# EAGLE design astronaut_interface (EAGLE 7.5.0)
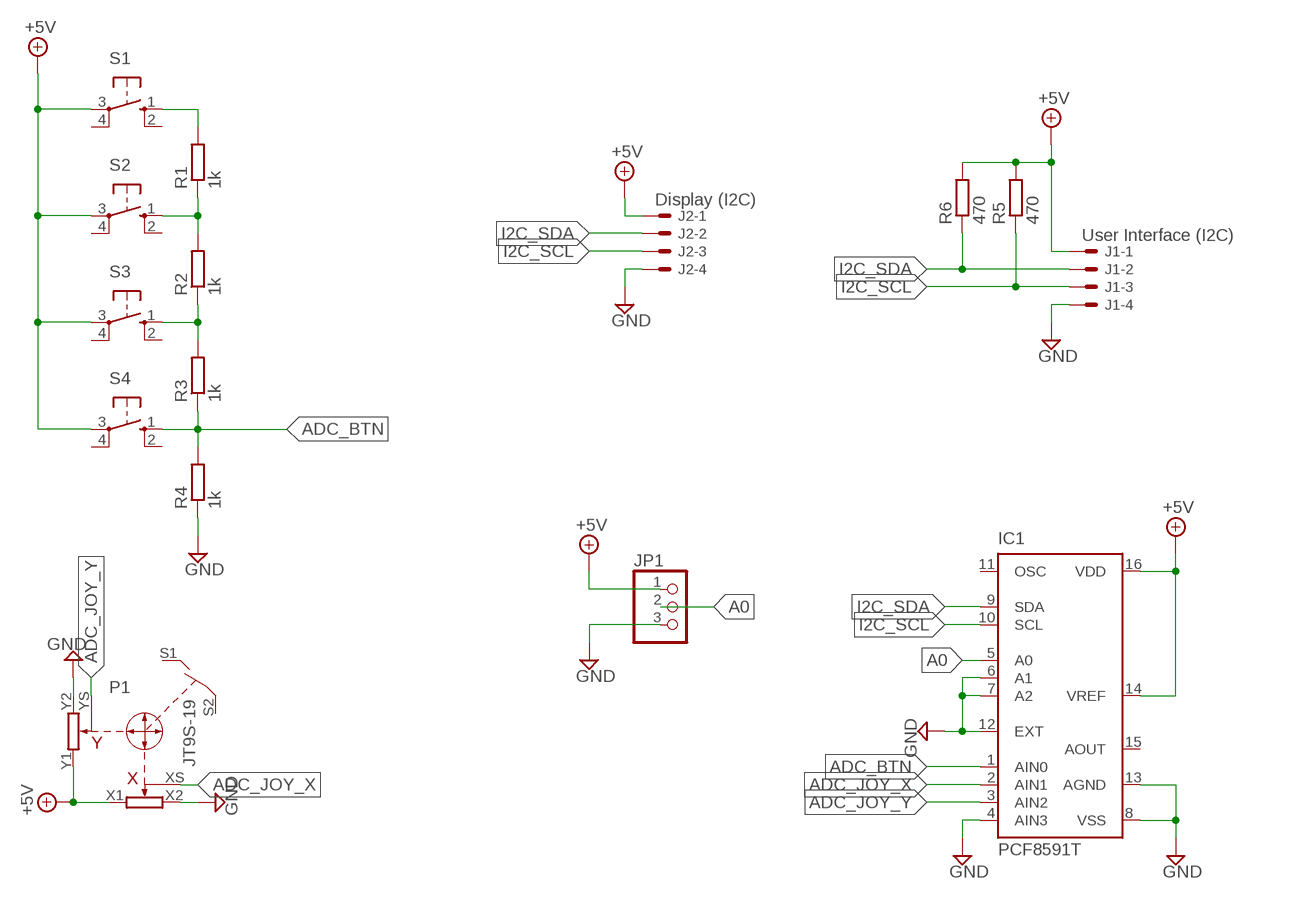
[diagram p0: schematic, sheet 1]

## Parts
IC1  PCF8591T  [SO16W]
J1  User Interface (I2C)  22-05-7048-04  [7395-04]
J2  Display (I2C)  22-05-7048-04  [7395-04]
JP1  PINHD-1X3  [1X03]
P1  JT9S-19  [JT9S-1P]
R1  1k  R-EU_R0805  [R0805]
R2  1k  R-EU_R0805  [R0805]
R3  1k  R-EU_R0805  [R0805]
R4  1k  R-EU_R0805  [R0805]
R5  470  R-EU_M0805  [M0805]
R6  470  R-EU_M0805  [M0805]
S1  10-XX  [B3F-10XX]
S2  10-XX  [B3F-10XX]
S3  10-XX  [B3F-10XX]
S4  10-XX  [B3F-10XX]

## Nets
+5V: IC1.14(VREF) IC1.16(VDD) J1.1 J2.1 JP1.1 P1.X1 P1.Y1 R5.2 R6.2 S1.3(P) S2.3(P) S3.3(P) S4.3(P)
A0: IC1.5(A0) JP1.2
ADC_BTN: IC1.1(AIN0) R3.1 R4.2 S4.1(S)
ADC_JOY_X: IC1.2(AIN1) P1.XS
ADC_JOY_Y: IC1.3(AIN2) P1.YS
GND: IC1.4(AIN3) IC1.6(A1) IC1.7(A2) IC1.8(VSS) IC1.12(EXT) IC1.13(AGND) J1.4 J2.4 JP1.3 P1.X2 P1.Y2 R4.1
I2C_SCL: IC1.10(SCL) J1.3 J2.3 R5.1
I2C_SDA: IC1.9(SDA) J1.2 J2.2 R6.1
N$4: R1.2 S1.1(S)
N$6: R2.1 R3.2 S3.1(S)
N$7: R1.1 R2.2 S2.1(S)
Unconnected: IC1.11(OSC) IC1.15(AOUT) P1.S1 P1.S2 S1.2(S1) S1.4(P1) S2.2(S1) S2.4(P1) S3.2(S1) S3.4(P1) S4.2(S1) S4.4(P1)

## Library data of the parts
IC1 = micro-philips:PCF8591: I2C-Bus D/A CONVERTER; MPN: PCF8591T/2,512; OC_FARNELL: 1826767; OC_NEWARK: 70R6911
J1 J2 = EP_molex_6410_7395:22-?-04: CONNECTOR wire to board 2.54 mm (.1 inch) pitch header
JP1 = pinhead:PINHD-1X3: PIN HEADER
P1 = jt9s-1p:JT9S-19: Joystick Potentiometer 10k
R1-R4 = rcl:R-EU_: RESISTOR, European symbol
R5 R6 = resistor:R-EU_: RESISTOR, European symbol
S1-S4 = switch-omron:10-XX: OMRON SWITCH; MPN: B3F-1000; OC_FARNELL: 176432; OC_NEWARK: 36M3542

## Board
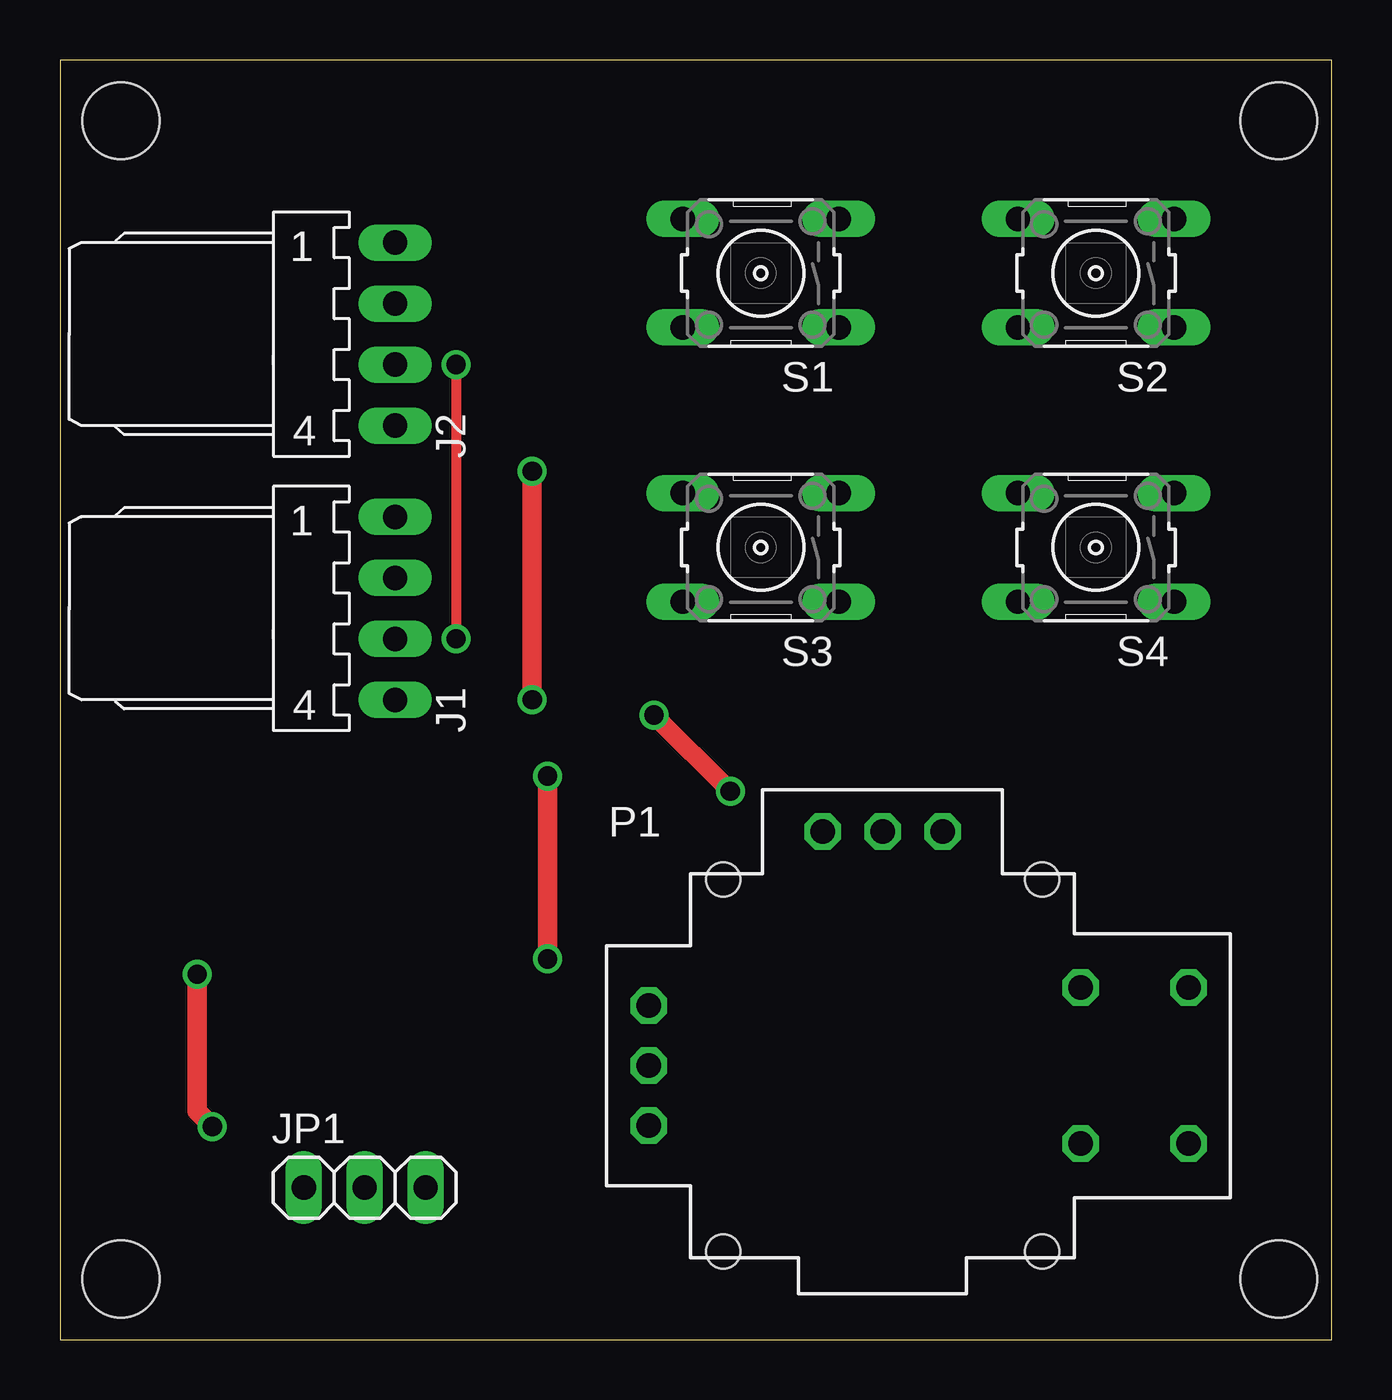
[diagram p1: board, top side]
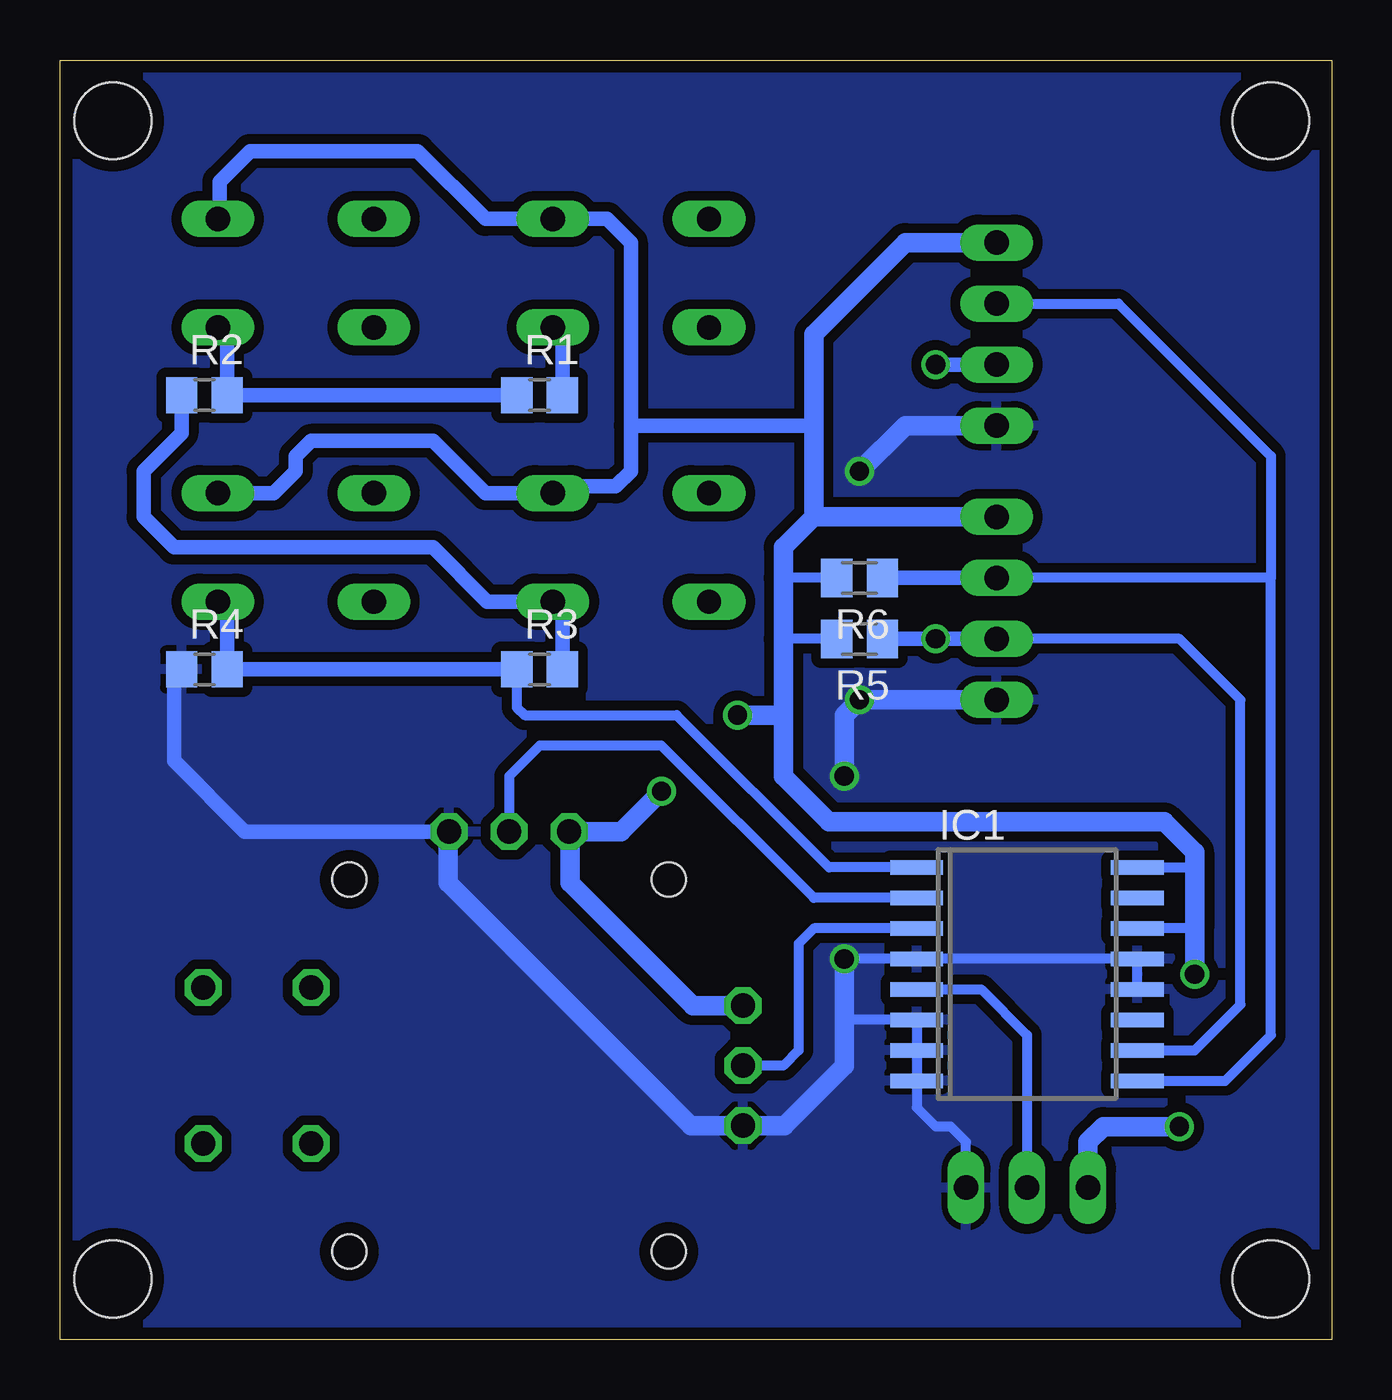
[diagram p2: board, bottom side, seen from below]

Size 53.01 x 53.33 mm. Coordinates in mm from the lower left corner, seen from the top.
Outline: 0,0 53.01,0 53.01,53.33 0,53.33 0,0
Copper layers (1*16): Top 0.035mm / dielectric 1.5mm / Bottom 0.035mm
Design rules "default *": minimum track width 12mil, minimum drill 24mil, track to track 12mil, track to pad 12mil, pad to pad 10mil, via to via 12mil, smd to smd 10mil, copper to edge 20mil, drill to drill 12mil, minimum pad ring 10mil, minimum via ring 8mil, stop-mask expansion 4mil, vias tented up to drill 0mil, thermal gap 10mil
Holes 3.2 mm at 50.8,2.54 50.8,50.8 2.54,50.8 2.54,2.54

### Footprints (pad centres in the part's own frame; a part is rotated, then mirrored left to right if it is on the bottom)
SO16W = smd 0.6 x 2.2: 1 -4.445,-4.6; 2 -3.175,-4.6; 3 -1.905,-4.6; 4 -0.635,-4.6; 5 0.635,-4.6; 6 1.905,-4.6; 7 3.175,-4.6; 8 4.445,-4.6; 9 4.445,4.6; 10 3.175,4.6; 11 1.905,4.6; 12 0.635,4.6; 13 -0.635,4.6; 14 -1.905,4.6; 15 -3.175,4.6; 16 -4.445,4.6
7395-04 = drill 1.016 long: 1 3.81,0; 2 1.27,0; 3 -1.27,0; 4 -3.81,0
1X03 = drill 1.016 long: 1 -2.54,0; 2 0,0; 3 2.54,0
JT9S-1P = drill 1.016 octagon: S1 8.25,-3.25; S2 12.75,3.25; S3 12.75,-3.25; S4 8.25,3.25; X1 -2.5,9.75; X2 2.5,9.75; XS 0,9.75; Y1 -9.75,2.5; Y2 -9.75,-2.5; YS -9.75,0 | hole 1.422: -6.65,7.75; 6.65,7.75; 6.65,-7.75; -6.65,-7.75
R0805 = smd 1.3 x 1.5: 1 -0.95,0; 2 0.95,0
M0805 = smd 1.3 x 1.6: 1 -0.95,0; 2 0.95,0
B3F-10XX = drill 1.016 long: 1 -3.251,2.261; 2 3.251,2.261; 3 -3.251,-2.261; 4 3.251,-2.261

### Placement (x,y rotation side)
IC1  12.7,15.24 270 bottom
J1  13.97,30.48 90 top
J2  13.97,41.91 90 top
JP1  12.7,6.35 0 top
P1  34.29,11.43 0 top
R1  33.02,39.37 0 bottom
R2  46.99,39.37 0 bottom
R3  33.02,27.94 0 bottom
R4  46.99,27.94 0 bottom
R5  19.69,29.21 180 bottom
R6  19.69,31.75 180 bottom
S1  29.21,44.45 180 top
S2  43.18,44.45 180 top
S3  29.21,33.02 180 top
S4  43.18,33.02 180 top

### Tracks (layer width: path | path; a pad name or v marks a point on that pad's centre or on a via)
+5V  (via drill 0.8)
  Top 0.813: v6.35,8.89 5.72,9.53 v5.72,15.24 | v27.94,22.86 v24.77,26.04
  Bottom 0.406: 46.36,46.79 S2.3 | 5.72,17.14 IC1.14 | IC1.16 5.72,19.68 | R6.2 22.86,31.75 | R5.2 22.86,29.21 | 31.75,21.14 P1.X1
  Bottom 0.61: 46.36,46.79 46.36,48.26 45.09,49.53 38.1,49.53 35.28,46.71 S1.3 30.2,46.71 29.21,45.72 29.21,38.1 | 29.21,38.1 29.21,36.2 29.84,35.56 32.18,35.56 S3.3 35.28,35.28 37.47,37.47 42.55,37.47 43.18,36.83 43.18,36.2 44.09,35.28 S4.3 | 21.59,38.1 29.21,38.1
  Bottom 0.813: JP1.1 10.16,8.26 9.52,8.89 v6.35,8.89 | v5.72,15.24 5.72,17.14 5.72,19.68 5.72,20.32 6.99,21.59 20.96,21.59 22.86,23.5 22.86,26.04 | J1.1 21.59,34.29 | J2.1 17.78,45.72 21.59,41.91 21.59,38.1 21.59,34.29 | P1.Y1 26.63,13.93 31.75,19.05 31.75,21.14 | P1.X1 29.62,21.18 v27.94,22.86 | 22.86,26.04 22.86,29.21 22.86,31.75 22.86,33.02 21.59,34.29 | v24.77,26.04 22.86,26.04
A0
  Bottom 0.406: IC1.5 14.61,14.61 12.7,12.7 JP1.2
ADC_BTN
  Bottom 0.406: IC1.1 20.96,19.68 27.3,26.04 33.66,26.04 33.97,26.35 R3.1
  Bottom 0.61: S4.1 46.04,30.37 R4.2 R3.1
ADC_JOY_X
  Bottom 0.406: P1.XS 34.29,23.5 33.02,24.77 27.94,24.77 21.59,18.41 IC1.2
ADC_JOY_Y
  Bottom 0.406: P1.YS 22.86,11.43 22.23,12.06 22.23,16.51 21.59,17.14 IC1.3
GND  (via drill 0.8)
  Top 0.813: v19.69,26.67 v19.69,36.2 | v20.32,15.88 v20.32,23.5
  Bottom 0.406: 36.83,21.14 P1.X2 | IC1.12 IC1.13 IC1.4 v20.32,15.88 | 20.32,13.34 IC1.6 IC1.7 IC1.8 17.3,9.68 16.51,8.89 15.88,8.89 15.24,8.26 JP1.3
  Bottom 0.61: P1.X2 45.31,21.18 48.26,24.13 48.26,27.62 R4.1
  Bottom 0.813: 36.83,21.14 36.83,19.05 26.71,8.93 P1.Y2 22.82,8.93 20.32,11.43 20.32,13.34 v20.32,15.88 | J1.4 v19.69,26.67 20.32,26.04 v20.32,23.5 | v19.69,36.2 17.78,38.1 J2.4
  pour Bottom (isolate 0.406): 0,53.34 53.34,53.34 53.34,0 0,0
I2C_SCL  (via drill 0.8)
  Top 0.406: v16.51,40.64 v16.51,29.21
  Bottom 0.406: IC1.10 5.72,12.06 3.81,13.97 3.81,26.67 6.35,29.21 J1.3
  Bottom 0.61: R5.1 v16.51,29.21 J1.3 | J2.3 v16.51,40.64
I2C_SDA
  Bottom 0.406: IC1.9 4.45,10.79 2.54,12.7 2.54,31.75 | 2.54,31.75 J1.2 | J2.2 8.89,43.18 2.54,36.83 2.54,31.75
  Bottom 0.61: R6.1 J1.2
N$4
  Bottom 0.61: R1.2 32.07,41.8 S1.1
N$6
  Bottom 0.61: R3.2 32.07,30.37 S3.1 35.2,30.76 37.47,33.02 48.26,33.02 49.53,34.29 49.53,36.2 47.94,37.78 R2.1
N$7
  Bottom 0.61: S2.1 46.04,41.8 R2.2 R1.1

### Text on the board
Document: prostokąt to moduł wyświetlacza 4x20 (całe PCB)